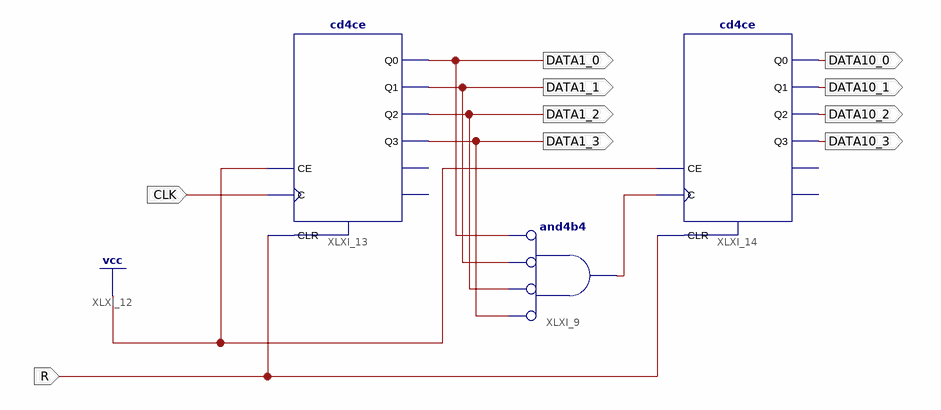
[diagram p0: schematic sheet 1]
// Xilinx ISE schematic counter00_99.sch (spartan6) as structural Verilog: 3 symbols, 10 ports
module counter00_99 (
  input  CLK,
  input  R,
  output DATA1_0,
  output DATA1_1,
  output DATA1_2,
  output DATA1_3,
  output DATA10_0,
  output DATA10_1,
  output DATA10_2,
  output DATA10_3
);

  wire XLXN_19;

  and XLXI_9 (XLXN_19, ~DATA1_3, ~DATA1_2, ~DATA1_1, ~DATA1_0);  // and4b4
  cd4ce XLXI_13 (.C(CLK), .CE(1'b1), .CLR(R), .Q0(DATA1_0), .Q1(DATA1_1), .Q2(DATA1_2), .Q3(DATA1_3));  // open: CEO, TC
  cd4ce XLXI_14 (
    .C(XLXN_19), .CE(1'b1), .CLR(R), .Q0(DATA10_0), .Q1(DATA10_1), .Q2(DATA10_2), .Q3(DATA10_3));  // open: CEO, TC
endmodule
